# EAGLE design RAM (EAGLE 9.6.2)
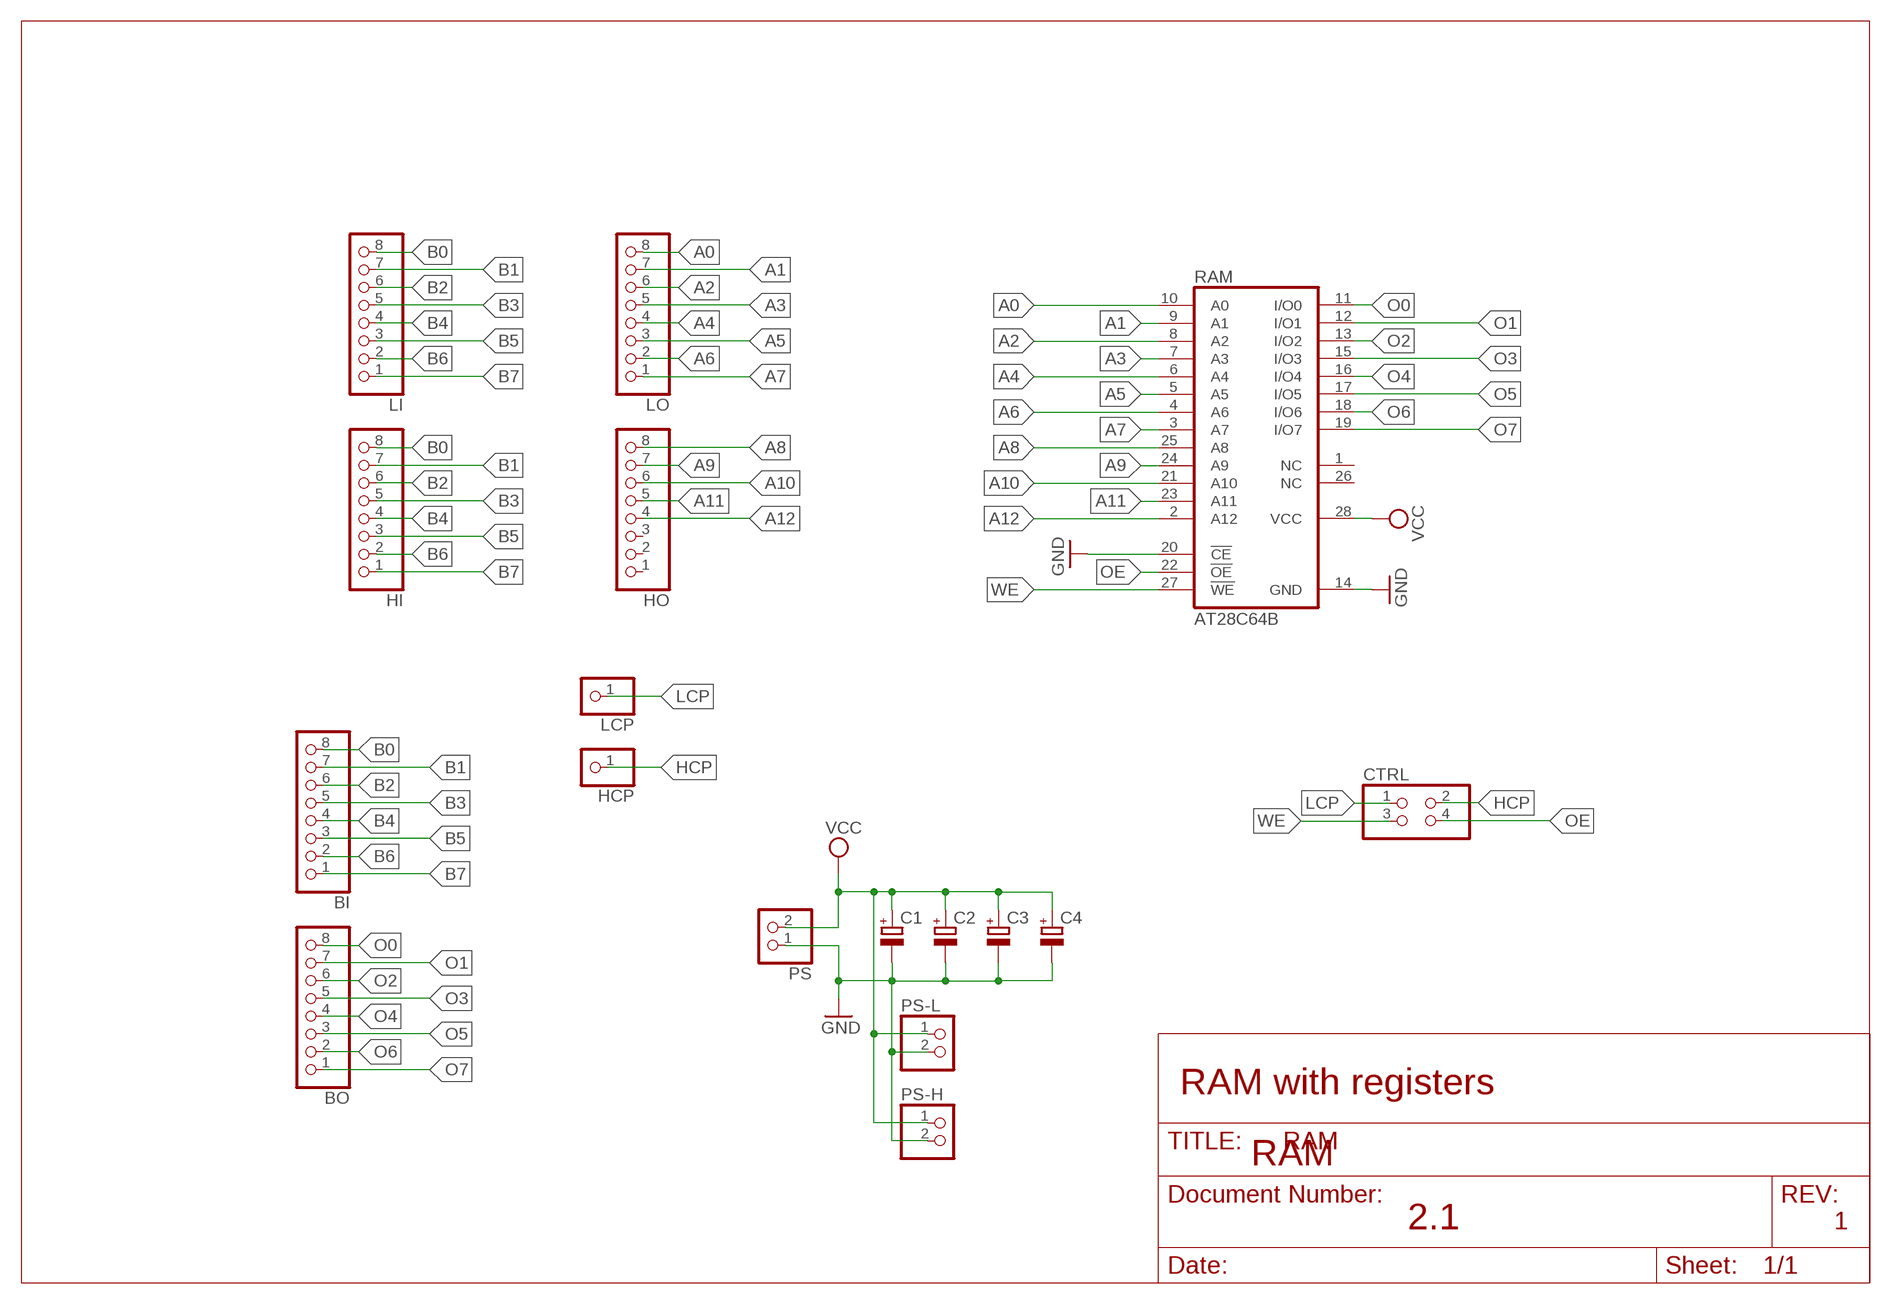
[diagram p0: schematic, sheet 1]

## Parts
BI  PINHD-1X8  [1X08]
BO  PINHD-1X8  [1X08]
C1  CPOL-EUE2.5-6  [E2,5-6]
C2  CPOL-EUE2.5-6  [E2,5-6]
C3  CPOL-EUE2.5-6  [E2,5-6]
C4  CPOL-EUE2.5-6  [E2,5-6]
CTRL  PINHD-2X2  [2X02]
HCP  PINHD-1X1  [1X01]
HI  PINHD-1X8  [1X08]
HO  PINHD-1X8  [1X08]
LCP  PINHD-1X1  [1X01]
LI  PINHD-1X8  [1X08]
LO  PINHD-1X8  [1X08]
PS  PINHD-1X2  [1X02]
PS-H  PINHD-1X2  [1X02]
PS-L  PINHD-1X2  [1X02]
RAM  AT28C64B  28C64C  [DIL28-6]

## Nets
A0: LO.8 RAM.10(A0)
A1: LO.7 RAM.9(A1)
A2: LO.6 RAM.8(A2)
A3: LO.5 RAM.7(A3)
A4: LO.4 RAM.6(A4)
A5: LO.3 RAM.5(A5)
A6: LO.2 RAM.4(A6)
A7: LO.1 RAM.3(A7)
A8: HO.8 RAM.25(A8)
A9: HO.7 RAM.24(A9)
A10: HO.6 RAM.21(A10)
A11: HO.5 RAM.23(A11)
A12: HO.4 RAM.2(A12)
B0: BI.8 HI.8 LI.8
B1: BI.7 HI.7 LI.7
B2: BI.6 HI.6 LI.6
B3: BI.5 HI.5 LI.5
B4: BI.4 HI.4 LI.4
B5: BI.3 HI.3 LI.3
B6: BI.2 HI.2 LI.2
B7: BI.1 HI.1 LI.1
GND: C1.- C2.- C3.- C4.- PS-H.2 PS-L.2 PS.1 RAM.14(GND) RAM.20(!CE)
HCP: CTRL.2 HCP.1
LCP: CTRL.1 LCP.1
O0: BO.8 RAM.11(I/O0)
O1: BO.7 RAM.12(I/O1)
O2: BO.6 RAM.13(I/O2)
O3: BO.5 RAM.15(I/O3)
O4: BO.4 RAM.16(I/O4)
O5: BO.3 RAM.17(I/O5)
O6: BO.2 RAM.18(I/O6)
O7: BO.1 RAM.19(I/O7)
OE: CTRL.4 RAM.22(!OE)
VCC: C1.+ C2.+ C3.+ C4.+ PS-H.1 PS-L.1 PS.2 RAM.28(VCC)
WE: CTRL.3 RAM.27(!WE)
Unconnected: HO.1 HO.2 HO.3 RAM.1(NC) RAM.26(NC)

## Notes on the sheet
- RAM with registers
- RAM
- 2.1 | 1

## Library data of the parts
BI BO HI HO LI LO = pinhead:PINHD-1X8: PIN HEADER
C1-C4 = rcl:CPOL-EU: POLARIZED CAPACITOR, European symbol; SPICEPREFIX: C
CTRL = pinhead:PINHD-2X2: PIN HEADER
HCP LCP = pinhead:PINHD-1X1: PIN HEADER
PS PS-H PS-L = pinhead:PINHD-1X2: PIN HEADER
RAM = memory-nec:28C64C: MEMORY; MPN: AT28C64B-15PU; OC_FARNELL: 1095784; OC_NEWARK: 96K6557

## Board
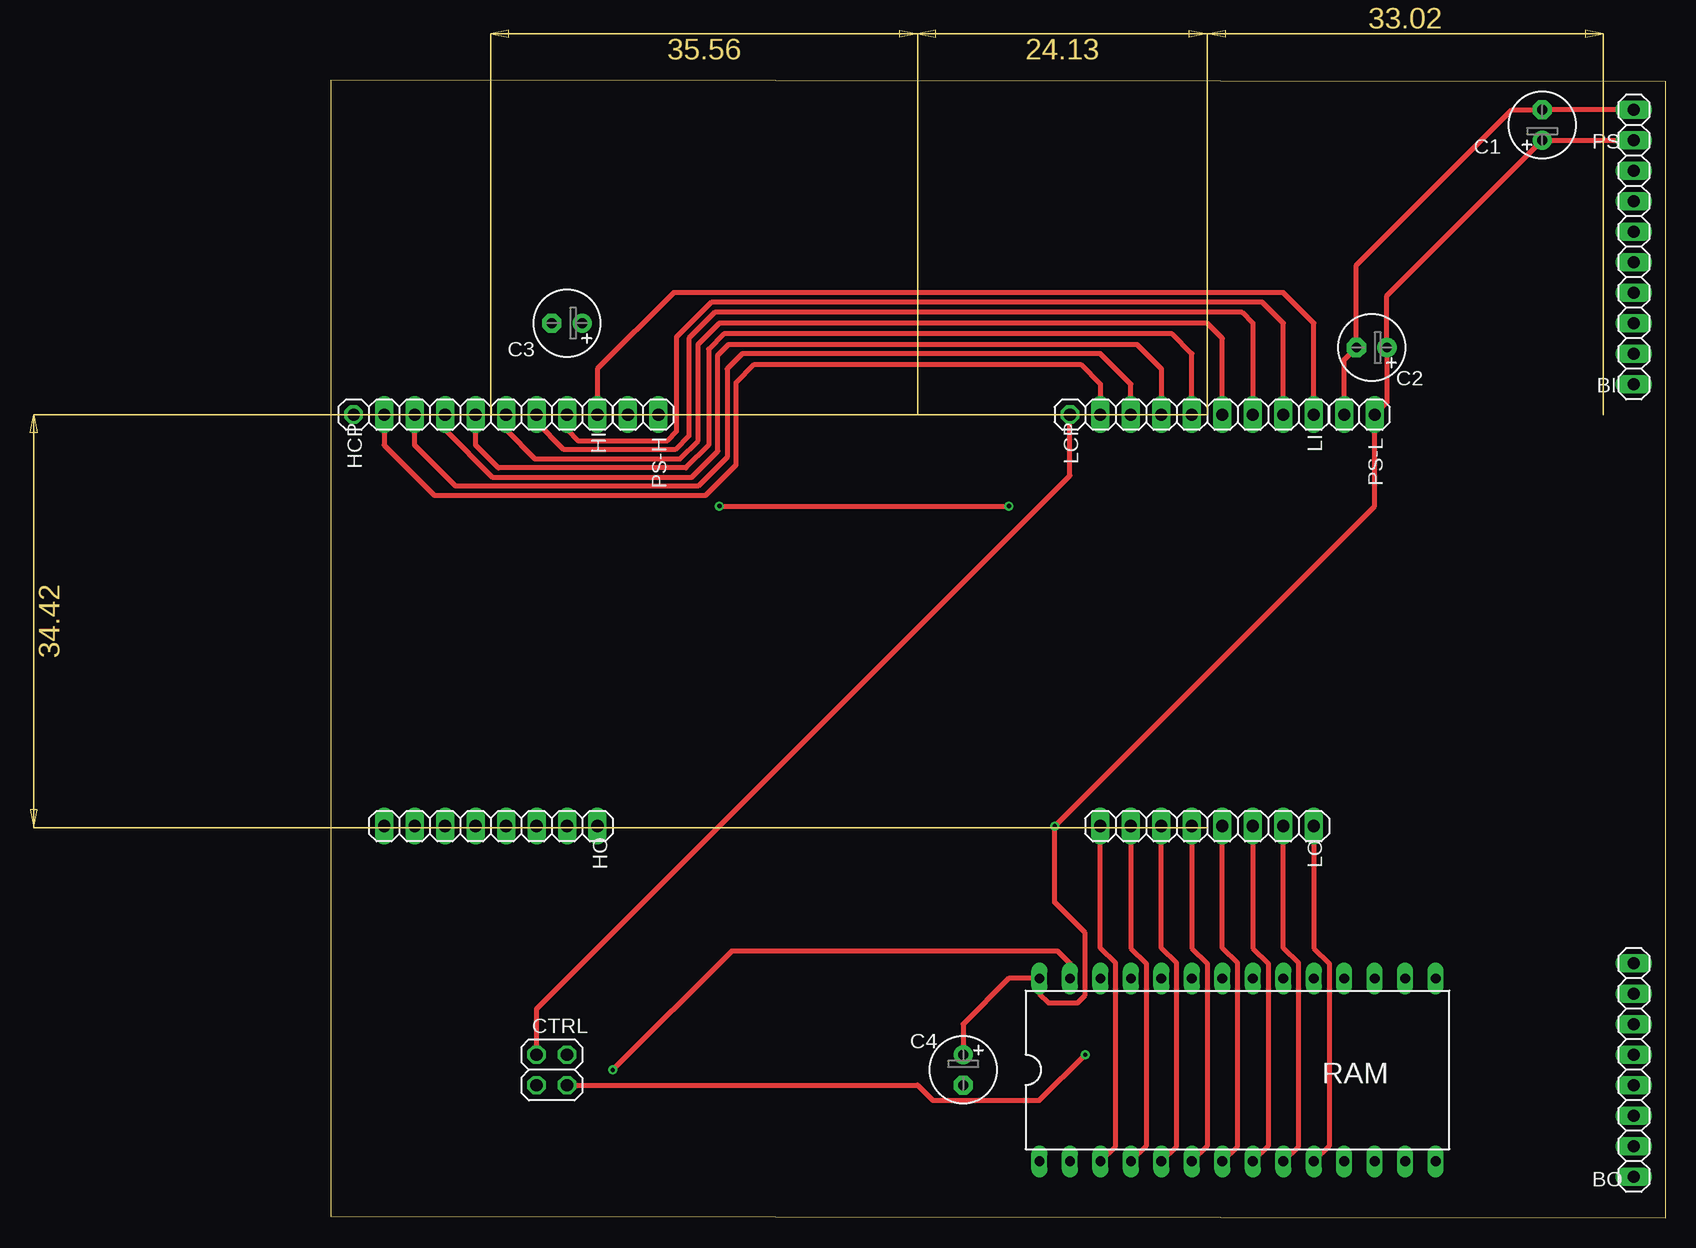
[diagram p1: board, top side]
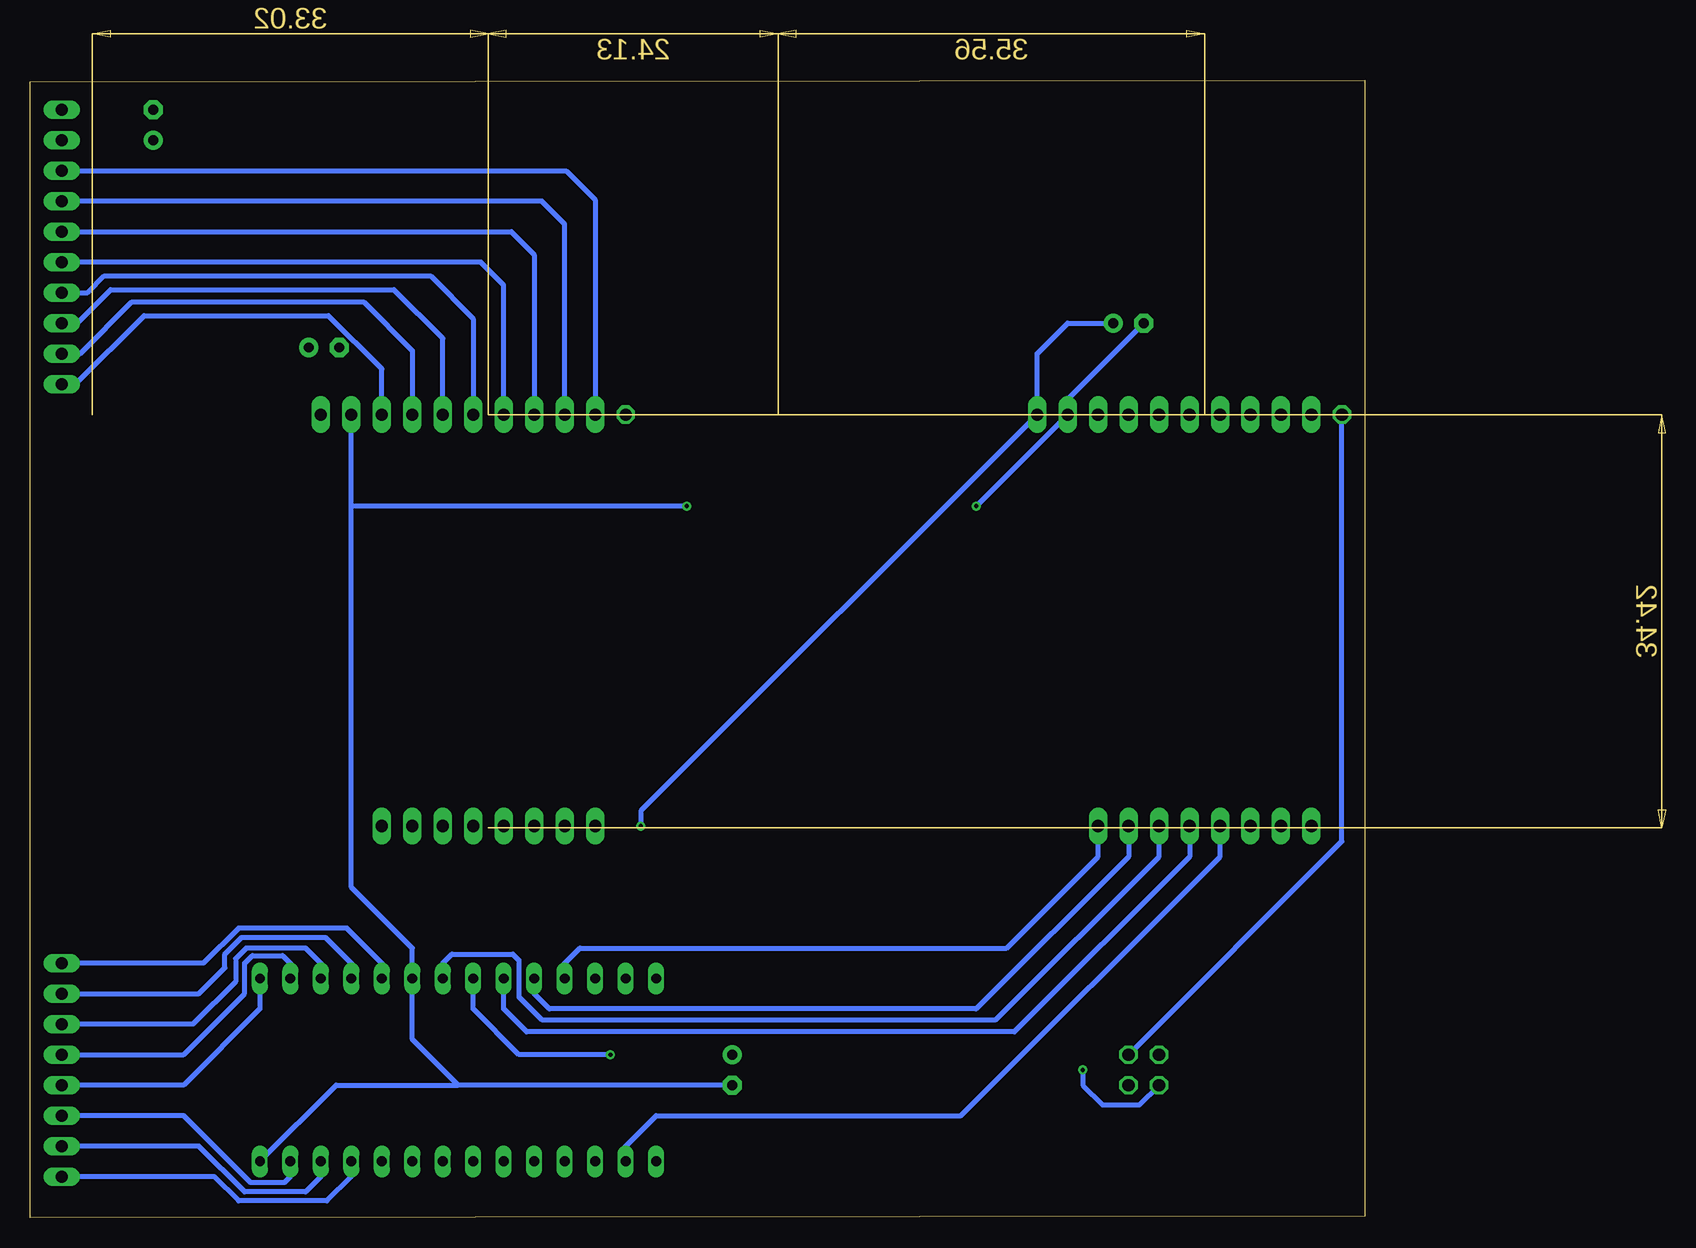
[diagram p2: board, bottom side, seen from below]

Size 111.23 x 94.79 mm. Coordinates in mm from the lower left corner, seen from the top.
Outline: 0,0.13 111.23,0 111.23,94.67 0,94.79 0,0.13
Copper layers (1*16): Top 0.035mm / dielectric 1.5mm / Bottom 0.035mm
Design rules "default": minimum track width 6mil, minimum drill 0.35mm, track to track 6mil, track to pad 6mil, pad to pad 6mil, via to via 6mil, smd to smd 6mil, copper to edge 40mil, drill to drill 6mil, minimum pad ring 10mil, minimum via ring 8mil, stop-mask expansion 4mil, vias tented up to drill 0mil, thermal gap 10mil

### Footprints (pad centres in the part's own frame; a part is rotated, then mirrored left to right if it is on the bottom)
1X08 = drill 1.016 long: 1 -8.89,0; 2 -6.35,0; 3 -3.81,0; 4 -1.27,0; 5 1.27,0; 6 3.81,0; 7 6.35,0; 8 8.89,0
E2,5-6 = drill 0.813 pad 1.6: + -1.27,0 | drill 0.813 pad 1.6 octagon: - 1.27,0
2X02 = drill 1.016 octagon: 1 -1.27,-1.27; 2 -1.27,1.27; 3 1.27,-1.27; 4 1.27,1.27
1X01 = drill 1.016 octagon: 1 0,0
1X02 = drill 1.016 long: 1 -1.27,0; 2 1.27,0
DIL28-6 = drill 0.813 long: 1 -16.51,-7.62; 2 -13.97,-7.62; 3 -11.43,-7.62; 4 -8.89,-7.62; 5 -6.35,-7.62; 6 -3.81,-7.62; 7 -1.27,-7.62; 8 1.27,-7.62; 9 3.81,-7.62; 10 6.35,-7.62; 11 8.89,-7.62; 12 11.43,-7.62; 13 13.97,-7.62; 14 16.51,-7.62; 15 16.51,7.62; 16 13.97,7.62; 17 11.43,7.62; 18 8.89,7.62; 19 6.35,7.62; 20 3.81,7.62; 21 1.27,7.62; 22 -1.27,7.62; 23 -3.81,7.62; 24 -6.35,7.62; 25 -8.89,7.62; 26 -11.43,7.62; 27 -13.97,7.62; 28 -16.51,7.62

### Placement (x,y rotation side)
BI  108.58,78.36 270 top
BO  108.58,12.32 270 top
C1  100.97,91.06 90 top
C2  86.74,72.52 180 top
C3  19.68,74.55 180 top
C4  52.7,12.32 270 top
CTRL  18.41,12.32 270 top
HCP  1.91,66.93 0 top
HI  13.34,66.93 0 top
HO  13.34,32.64 0 top
LCP  61.59,66.93 0 top
LI  73.03,66.93 0 top
LO  73.03,32.64 0 top
PS  108.58,91.06 270 top
PS-H  26.04,66.93 180 top
PS-L  85.72,66.93 180 top
RAM  75.56,12.32 0 top

### Tracks (layer width: path | path; a pad name or v marks a point on that pad's centre or on a via)
A0
  Top 0.4: LO.8 81.92,22.48 83.19,21.21 83.19,5.97 RAM.10
A1
  Top 0.4: RAM.9 80.64,5.97 80.64,21.21 79.38,22.48 LO.7
A2
  Top 0.4: LO.6 76.83,22.48 78.11,21.21 78.11,5.97 RAM.8
A3
  Top 0.4: RAM.7 75.56,5.97 75.56,21.21 74.3,22.48 LO.5
A4
  Top 0.4: LO.4 71.75,22.48 73.03,21.21 73.03,5.97 RAM.6
A5
  Top 0.4: RAM.5 70.48,5.97 70.48,21.21 69.22,22.48 LO.3
A6
  Top 0.4: LO.2 66.67,22.48 67.94,21.21 67.94,5.97 RAM.4
A7
  Top 0.4: RAM.3 65.41,5.97 65.41,21.21 64.14,22.48 LO.1
A8
  Bottom 0.4: RAM.25 66.67,21.21 65.41,22.48 29.84,22.48 22.23,30.1 HO.8
A9
  Bottom 0.4: HO.7 19.68,30.1 32.38,17.4 67.94,17.4 69.22,18.67 RAM.24
A10
  Bottom 0.4: RAM.21 76.83,21.21 76.07,21.97 70.99,21.97 70.48,21.46 70.48,18.41 68.58,16.51 30.73,16.51 17.14,30.1 HO.6
A11
  Bottom 0.4: HO.5 14.61,30.1 29.21,15.49 69.85,15.49 71.75,17.4 RAM.23
A12
  Bottom 0.4: RAM.2 61.59,5.97 59.05,8.51 33.66,8.51 12.06,30.1 HO.4
B0
  Top 0.4: LI.8 81.92,74.55 79.38,77.09 28.57,77.09 22.23,70.74 HI.8
  Bottom 0.4: LI.8 81.92,70.74 86.36,75.18 101.73,75.18 107.44,69.47 BI.8
B1
  Top 0.4: LI.7 79.38,74.55 77.6,76.33 31.75,76.33 28.83,73.41 28.83,65.53 28.07,64.77 20.57,64.77 19.68,65.66 HI.7
  Bottom 0.4: LI.7 79.38,72.26 83.44,76.33 102.74,76.33 107.06,72.01 BI.7
B2
  Top 0.4: HI.6 17.14,66.29 19.43,64.01 28.7,64.01 29.84,65.15 29.84,73.28 32,75.44 75.95,75.44 76.83,74.55 LI.6
  Bottom 0.4: BI.6 107.31,74.55 104.52,77.34 80.9,77.34 76.83,73.28 LI.6
B3
  Top 0.4: HI.5 14.61,65.66 17.02,63.25 29.08,63.25 30.61,64.77 30.61,72.77 32.38,74.55 73.03,74.55 74.3,73.28 LI.5
  Bottom 0.4: LI.5 74.3,74.93 77.85,78.49 105.03,78.49 106.43,77.09 BI.5
B4
  Top 0.4: HI.4 12.06,64.39 13.97,62.48 29.59,62.48 31.5,64.39 31.5,72.39 32.77,73.66 70.1,73.66 71.75,72.01 LI.4
  Bottom 0.4: LI.4 71.75,77.72 73.66,79.63 BI.4
B5
  Top 0.4: HI.3 9.53,65.66 13.46,61.72 30.1,61.72 32.26,63.88 32.26,71.88 33.15,72.77 67.18,72.77 69.22,70.74 LI.3
  Bottom 0.4: LI.3 69.22,80.26 71.12,82.17 BI.3
B6
  Top 0.4: HI.2 6.99,64.39 10.41,60.96 30.61,60.96 33.02,63.37 33.02,70.74 34.29,72.01 64.14,72.01 66.67,69.47 LI.2
  Bottom 0.4: BI.2 68.58,84.71 66.67,82.8 LI.2
B7
  Top 0.4: LI.1 64.14,69.47 62.48,71.12 35.31,71.12 33.78,69.6 33.78,62.74 31.24,60.2 8.64,60.2 4.45,64.39 HI.1
  Bottom 0.4: BI.1 66.55,87.25 64.14,84.84 LI.1
GND  (via drill 0.35)
  Top 0.4: PS-L.2 84.45,71.5 C2.- 85.47,79.38 98.42,92.33 C1.- PS.1 | v32.38,59.31 v56.52,59.31
  Bottom 0.4: C3.- 24.77,68.2 PS-H.2 v32.38,59.31 | C4.- 75.56,11.05 | 75.56,11.05 79.38,14.86 RAM.20 79.38,22.48 84.45,27.56 84.45,59.31 | RAM.14 85.72,11.05 75.56,11.05 | 84.45,59.31 PS-L.2 | v56.52,59.31 84.45,59.31
HCP
  Bottom 0.4: CTRL.2 1.91,31.37 HCP.1
LCP
  Top 0.4: CTRL.1 17.14,17.4 61.59,61.85 LCP.1
O0
  Bottom 0.4: RAM.11 84.45,3.43 86.49,1.4 93.85,1.4 95.89,3.43 BO.8
O1
  Bottom 0.4: RAM.12 87,3.43 88.27,2.16 93.34,2.16 97.16,5.97 BO.7
O2
  Bottom 0.4: RAM.13 89.53,3.43 90.04,2.92 92.84,2.92 98.42,8.51 BO.6
O3
  Bottom 0.4: RAM.15 92.08,17.4 98.42,11.05 BO.5
O4
  Bottom 0.4: BO.4 98.42,13.59 93.34,18.67 93.34,21.21 92.71,21.84 90.17,21.84 89.53,21.21 RAM.16
O5
  Bottom 0.4: RAM.17 87,21.21 88.27,22.48 93.22,22.48 94.11,21.59 94.11,19.68 97.66,16.13 BO.3
O6
  Bottom 0.4: BO.2 97.16,18.67 95,20.83 95,21.97 93.6,23.37 86.61,23.37 84.45,21.21 RAM.18
O7
  Bottom 0.4: RAM.19 81.92,21.21 84.84,24.13 93.85,24.13 96.77,21.21 BO.1
OE  (via drill 0.35)
  Top 0.4: CTRL.4 48.9,11.05 50.16,9.78 59.05,9.78 v62.87,13.59
  Bottom 0.4: v62.87,13.59 70.48,13.59 74.3,17.4 RAM.22
VCC  (via drill 0.35)
  Top 0.4: C4.+ 52.7,16.13 56.52,19.94 RAM.28 59.05,18.67 59.82,17.91 62.23,17.91 62.87,18.54 62.87,23.75 60.33,26.29 v60.33,32.64 87,59.31 PS-L.1 88.01,67.94 C2.+ 88.01,76.83 C1.+ PS.2
  Bottom 0.4: C3.+ 24.77,74.55 27.3,72.01 PS-H.1 60.33,33.91 v60.33,32.64
WE  (via drill 0.35)
  Top 0.4: RAM.27 61.59,21.21 60.58,22.22 33.4,22.22 v23.5,12.32
  Bottom 0.4: v23.5,12.32 23.5,11.05 21.84,9.4 18.8,9.4 CTRL.3